# EAGLE design led reflector (EAGLE 6.2)
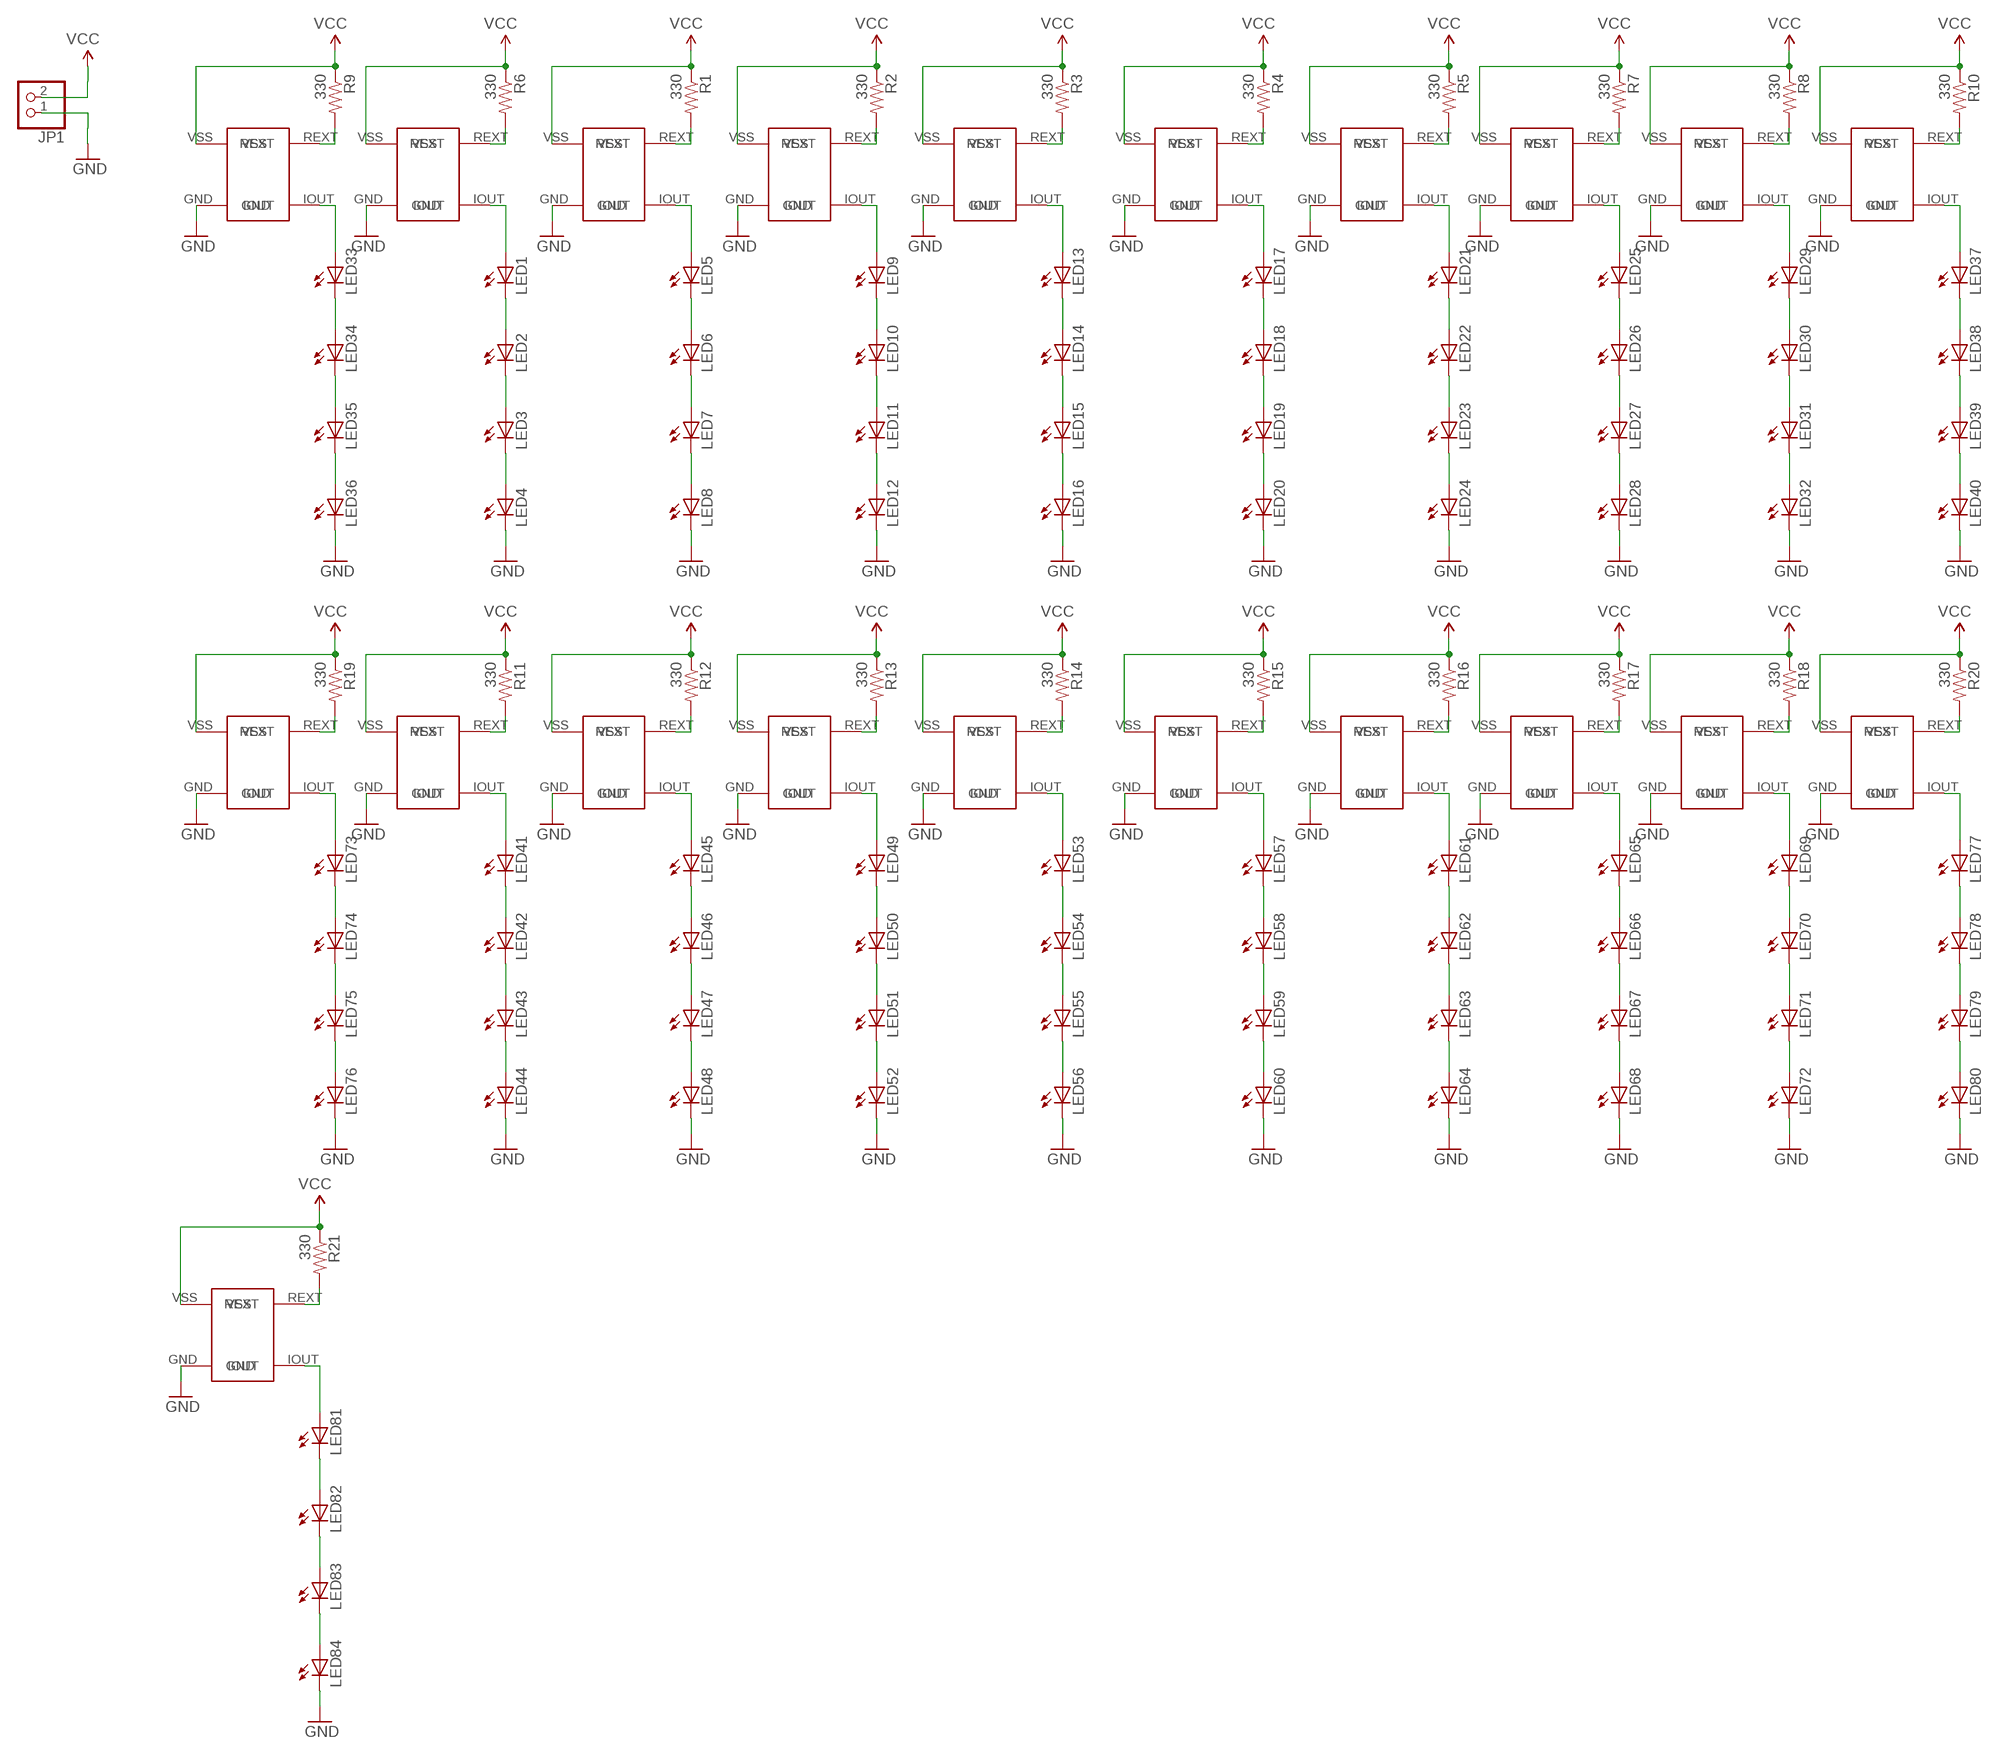
[diagram p0: schematic, sheet 1]

## Parts
JP1  PINHD-1X2  [1X02]
LED1  LED5MM  [LED5MM]
LED2  LED5MM  [LED5MM]
LED3  LED5MM  [LED5MM]
LED4  LED5MM  [LED5MM]
LED5  LED5MM  [LED5MM]
LED6  LED5MM  [LED5MM]
LED7  LED5MM  [LED5MM]
LED8  LED5MM  [LED5MM]
LED9  LED5MM  [LED5MM]
LED10  LED5MM  [LED5MM]
LED11  LED5MM  [LED5MM]
LED12  LED5MM  [LED5MM]
LED13  LED5MM  [LED5MM]
LED14  LED5MM  [LED5MM]
LED15  LED5MM  [LED5MM]
LED16  LED5MM  [LED5MM]
LED17  LED5MM  [LED5MM]
LED18  LED5MM  [LED5MM]
LED19  LED5MM  [LED5MM]
LED20  LED5MM  [LED5MM]
LED21  LED5MM  [LED5MM]
LED22  LED5MM  [LED5MM]
LED23  LED5MM  [LED5MM]
LED24  LED5MM  [LED5MM]
LED25  LED5MM  [LED5MM]
LED26  LED5MM  [LED5MM]
LED27  LED5MM  [LED5MM]
LED28  LED5MM  [LED5MM]
LED29  LED5MM  [LED5MM]
LED30  LED5MM  [LED5MM]
LED31  LED5MM  [LED5MM]
LED32  LED5MM  [LED5MM]
LED33  LED5MM  [LED5MM]
LED34  LED5MM  [LED5MM]
LED35  LED5MM  [LED5MM]
LED36  LED5MM  [LED5MM]
LED37  LED5MM  [LED5MM]
LED38  LED5MM  [LED5MM]
LED39  LED5MM  [LED5MM]
LED40  LED5MM  [LED5MM]
LED41  LED5MM  [LED5MM]
LED42  LED5MM  [LED5MM]
LED43  LED5MM  [LED5MM]
LED44  LED5MM  [LED5MM]
LED45  LED5MM  [LED5MM]
LED46  LED5MM  [LED5MM]
LED47  LED5MM  [LED5MM]
LED48  LED5MM  [LED5MM]
LED49  LED5MM  [LED5MM]
LED50  LED5MM  [LED5MM]
LED51  LED5MM  [LED5MM]
LED52  LED5MM  [LED5MM]
LED53  LED5MM  [LED5MM]
LED54  LED5MM  [LED5MM]
LED55  LED5MM  [LED5MM]
LED56  LED5MM  [LED5MM]
LED57  LED5MM  [LED5MM]
LED58  LED5MM  [LED5MM]
LED59  LED5MM  [LED5MM]
LED60  LED5MM  [LED5MM]
LED61  LED5MM  [LED5MM]
LED62  LED5MM  [LED5MM]
LED63  LED5MM  [LED5MM]
LED64  LED5MM  [LED5MM]
LED65  LED5MM  [LED5MM]
LED66  LED5MM  [LED5MM]
LED67  LED5MM  [LED5MM]
LED68  LED5MM  [LED5MM]
LED69  LED5MM  [LED5MM]
LED70  LED5MM  [LED5MM]
LED71  LED5MM  [LED5MM]
LED72  LED5MM  [LED5MM]
LED73  LED5MM  [LED5MM]
LED74  LED5MM  [LED5MM]
LED75  LED5MM  [LED5MM]
LED76  LED5MM  [LED5MM]
LED77  LED5MM  [LED5MM]
LED78  LED5MM  [LED5MM]
LED79  LED5MM  [LED5MM]
LED80  LED5MM  [LED5MM]
LED81  LED5MM  [LED5MM]
LED82  LED5MM  [LED5MM]
LED83  LED5MM  [LED5MM]
LED84  LED5MM  [LED5MM]
R1  330  RESISTOR  [0805]
R2  330  RESISTOR  [0805]
R3  330  RESISTOR  [0805]
R4  330  RESISTOR  [0805]
R5  330  RESISTOR  [0805]
R6  330  RESISTOR  [0805]
R7  330  RESISTOR  [0805]
R8  330  RESISTOR  [0805]
R9  330  RESISTOR  [0805]
R10  330  RESISTOR  [0805]
R11  330  RESISTOR  [0805]
R12  330  RESISTOR  [0805]
R13  330  RESISTOR  [0805]
R14  330  RESISTOR  [0805]
R15  330  RESISTOR  [0805]
R16  330  RESISTOR  [0805]
R17  330  RESISTOR  [0805]
R18  330  RESISTOR  [0805]
R19  330  RESISTOR  [0805]
R20  330  RESISTOR  [0805]
R21  330  RESISTOR  [0805]
U$1  BCR401W  [SOT-343]
U$2  BCR401W  [SOT-343]
U$3  BCR401W  [SOT-343]
U$4  BCR401W  [SOT-343]
U$5  BCR401W  [SOT-343]
U$6  BCR401W  [SOT-343]
U$7  BCR401W  [SOT-343]
U$8  BCR401W  [SOT-343]
U$9  BCR401W  [SOT-343]
U$10  BCR401W  [SOT-343]
U$11  BCR401W  [SOT-343]
U$12  BCR401W  [SOT-343]
U$13  BCR401W  [SOT-343]
U$14  BCR401W  [SOT-343]
U$15  BCR401W  [SOT-343]
U$16  BCR401W  [SOT-343]
U$17  BCR401W  [SOT-343]
U$18  BCR401W  [SOT-343]
U$19  BCR401W  [SOT-343]
U$20  BCR401W  [SOT-343]
U$21  BCR401W  [SOT-343]

## Nets
3.3V: JP1.2 R1.1 R2.1 R3.1 R4.1 R5.1 R6.1 R7.1 R8.1 R9.1 R10.1 R11.1 R12.1 R13.1 R14.1 R15.1 R16.1 R17.1 R18.1 R19.1 R20.1 R21.1 U$1.VSS U$2.VSS U$3.VSS U$4.VSS U$5.VSS U$6.VSS U$7.VSS U$8.VSS U$9.VSS U$10.VSS U$11.VSS U$12.VSS U$13.VSS U$14.VSS U$15.VSS U$16.VSS U$17.VSS U$18.VSS U$19.VSS U$20.VSS U$21.VSS ; supply symbol labelled VCC
GND: JP1.1 LED4.K(C) LED8.K(C) LED12.K(C) LED16.K(C) LED20.K(C) LED24.K(C) LED28.K(C) LED32.K(C) LED36.K(C) LED40.K(C) LED44.K(C) LED48.K(C) LED52.K(C) LED56.K(C) LED60.K(C) LED64.K(C) LED68.K(C) LED72.K(C) LED76.K(C) LED80.K(C) LED84.K(C) U$1.GND U$2.GND U$3.GND U$4.GND U$5.GND U$6.GND U$7.GND U$8.GND U$9.GND U$10.GND U$11.GND U$12.GND U$13.GND U$14.GND U$15.GND U$16.GND U$17.GND U$18.GND U$19.GND U$20.GND U$21.GND
N$1: LED1.A U$1.IOUT
N$2: LED1.K(C) LED2.A
N$3: LED2.K(C) LED3.A
N$4: LED3.K(C) LED4.A
N$5: R6.2 U$1.REXT
N$6: LED41.A U$11.IOUT
N$7: LED5.A U$2.IOUT
N$8: LED5.K(C) LED6.A
N$9: LED6.K(C) LED7.A
N$10: LED7.K(C) LED8.A
N$11: R1.2 U$2.REXT
N$12: LED9.A U$3.IOUT
N$13: LED9.K(C) LED10.A
N$14: LED10.K(C) LED11.A
N$15: LED11.K(C) LED12.A
N$16: R2.2 U$3.REXT
N$17: LED13.A U$4.IOUT
N$18: LED13.K(C) LED14.A
N$19: LED14.K(C) LED15.A
N$20: LED15.K(C) LED16.A
N$21: R3.2 U$4.REXT
N$22: LED17.A U$5.IOUT
N$23: LED17.K(C) LED18.A
N$24: LED18.K(C) LED19.A
N$25: LED19.K(C) LED20.A
N$26: R4.2 U$5.REXT
N$27: LED21.A U$6.IOUT
N$28: LED21.K(C) LED22.A
N$29: LED22.K(C) LED23.A
N$30: LED23.K(C) LED24.A
N$31: R5.2 U$6.REXT
N$32: LED25.A U$7.IOUT
N$33: LED25.K(C) LED26.A
N$34: LED26.K(C) LED27.A
N$35: LED27.K(C) LED28.A
N$36: R7.2 U$7.REXT
N$37: LED29.A U$8.IOUT
N$38: LED29.K(C) LED30.A
N$39: LED30.K(C) LED31.A
N$40: LED31.K(C) LED32.A
N$41: R8.2 U$8.REXT
N$42: LED33.A U$9.IOUT
N$43: LED33.K(C) LED34.A
N$44: LED34.K(C) LED35.A
N$45: LED35.K(C) LED36.A
N$46: R9.2 U$9.REXT
N$47: LED37.A U$10.IOUT
N$48: LED37.K(C) LED38.A
N$49: LED38.K(C) LED39.A
N$50: LED39.K(C) LED40.A
N$51: R10.2 U$10.REXT
N$52: LED41.K(C) LED42.A
N$53: LED42.K(C) LED43.A
N$54: LED43.K(C) LED44.A
N$55: R11.2 U$11.REXT
N$56: LED45.A U$12.IOUT
N$57: LED45.K(C) LED46.A
N$58: LED46.K(C) LED47.A
N$59: LED47.K(C) LED48.A
N$60: R12.2 U$12.REXT
N$61: LED49.A U$13.IOUT
N$62: LED49.K(C) LED50.A
N$63: LED50.K(C) LED51.A
N$64: LED51.K(C) LED52.A
N$65: R13.2 U$13.REXT
N$66: LED53.A U$14.IOUT
N$67: LED53.K(C) LED54.A
N$68: LED54.K(C) LED55.A
N$69: LED55.K(C) LED56.A
N$70: R14.2 U$14.REXT
N$71: LED57.A U$15.IOUT
N$72: LED57.K(C) LED58.A
N$73: LED58.K(C) LED59.A
N$74: LED59.K(C) LED60.A
N$75: R15.2 U$15.REXT
N$76: LED61.A U$16.IOUT
N$77: LED61.K(C) LED62.A
N$78: LED62.K(C) LED63.A
N$79: LED63.K(C) LED64.A
N$80: R16.2 U$16.REXT
N$81: LED65.A U$17.IOUT
N$82: LED65.K(C) LED66.A
N$83: LED66.K(C) LED67.A
N$84: LED67.K(C) LED68.A
N$85: R17.2 U$17.REXT
N$86: LED69.A U$18.IOUT
N$87: LED69.K(C) LED70.A
N$88: LED70.K(C) LED71.A
N$89: LED71.K(C) LED72.A
N$90: R18.2 U$18.REXT
N$91: LED73.A U$19.IOUT
N$92: LED73.K(C) LED74.A
N$93: LED74.K(C) LED75.A
N$94: LED75.K(C) LED76.A
N$95: R19.2 U$19.REXT
N$96: LED77.A U$20.IOUT
N$97: LED77.K(C) LED78.A
N$98: LED78.K(C) LED79.A
N$99: LED79.K(C) LED80.A
N$100: R20.2 U$20.REXT
N$101: LED81.A U$21.IOUT
N$102: LED81.K(C) LED82.A
N$103: LED82.K(C) LED83.A
N$104: LED83.K(C) LED84.A
N$105: R21.2 U$21.REXT

## Library data of the parts
JP1 = pinhead:PINHD-1X2: PIN HEADER
LED1-LED84 = led:LED: LED OSRAM: - CHIPLED LG R971, LG N971, LY N971, LG Q971, LY Q971, LO R971, LY R971 LH N974, LH R974 LS Q976, LO Q976, LY Q976 LO Q996 - Hyper CHIPLED LW Q18S LB Q993, LB Q99A, LB R99A - SideLED LS A670, LO A670, LY A670, LG A670, LP A670 LB A673, LV A673, LT A673, LW A673 LH A674 LY A675 LS A676, LA A676, LO A676, LY A676, LW A676 LS A679, LY A679, LG A679 - Hyper Micro SIDELED® LS Y876, LA Y876, LO Y876, LY Y876 LT Y87S - SmartLED LW L88C, LW L88S LB L89C, LB L89S, LG L890 LS L89K, LO L89K, LY L89K LS L896, LA L896, LO L896, LY L896 - TOPLED LS T670, LO T670, LY T670, LG T670, LP T670 LSG T670, LSP T670, LSY T670, LOP T670, LYG T670 LG T671, LOG T671, LSG T671 LB T673, LV T673, LT T673, LW T673 LH T674 LS T676, LA T676, LO T676, LY T676, LB T676, LH T676, LSB T676, LW T676 LB T67C, LV T67C, LT T67C, LS T67K, LO T67K, LY T67K, LW E67C LS E67B, LA E67B, LO E67B, LY E67B, LB E67C, LV E67C, LT E67C LW T67C LS T679, LY T679, LG T679 LS T770, LO T770, LY T770, LG T770, LP T770 LB T773, LV T773, LT T773, LW T773 LH T774 LS E675, LA E675, LY E675, LS T675 LS T776, LA T776, LO T776, LY T776, LB T776 LHGB T686 LT T68C, LB T68C - Hyper Mini TOPLED® LB M676 - Mini TOPLED Santana® LG M470 LS M47K, LO M47K, LY M47K Source: http://www.osram.convergy.de LUXEON: - LUMILED® LXK2-PW12-R00, LXK2-PW12-S00, LXK2-PW14-U00, LXK2-PW14-V00 LXK2-PM12-R00, LXK2-PM12-S00, LXK2-PM14-U00 LXK2-PE12-Q00, LXK2-PE12-R00, LXK2-PE12-S00, LXK2-PE14-T00, LXK2-PE14-U00 LXK2-PB12-K00, LXK2-PB12-L00, LXK2-PB12-M00, LXK2-PB14-N00, LXK2-PB14-P00, LXK2-PB14-Q00 LXK2-PR12-L00, LXK2-PR12-M00, LXK2-PR14-Q00, LXK2-PR14-R00 LXK2-PD12-Q00, LXK2-PD12-R00, LXK2-PD12-S00 LXK2-PH12-R00, LXK2-PH12-S00 LXK2-PL12-P00, LXK2-PL12-Q00, LXK2-PL12-R00 Source: www.luxeon.com KINGBRIGHT: KA-3528ASYC Source: www.kingbright.com
R1-R21 = SparkFun:RESISTOR: Resistor Basic schematic elements and footprints for 0603, 1206, and PTH 1/10th watt (small) resistors.
U$1-U$21 = bcr401w:BCR401W: LED DRIVER, LOW POWER LEDS, 4SOT343 LED Driver Application: Aircraft, LED Strips for Decorative Lighting, Ship Illumination, Train Topology: Constant Current No. of Outputs: 1 Output Current: 10mA Output Voltage: 16V Dimming Control Type: Digital Driver Case Style: SOT-343 SVHC: No SVHC (19-Dec-2011) Device Type: LED No. of Pins: 4 Supply Voltage Max: 18V Termination Type: SMD http://ro.farnell.com/infineon/bcr401w/led-driver-low-power-leds-4sot343/dp/1791058

## Board
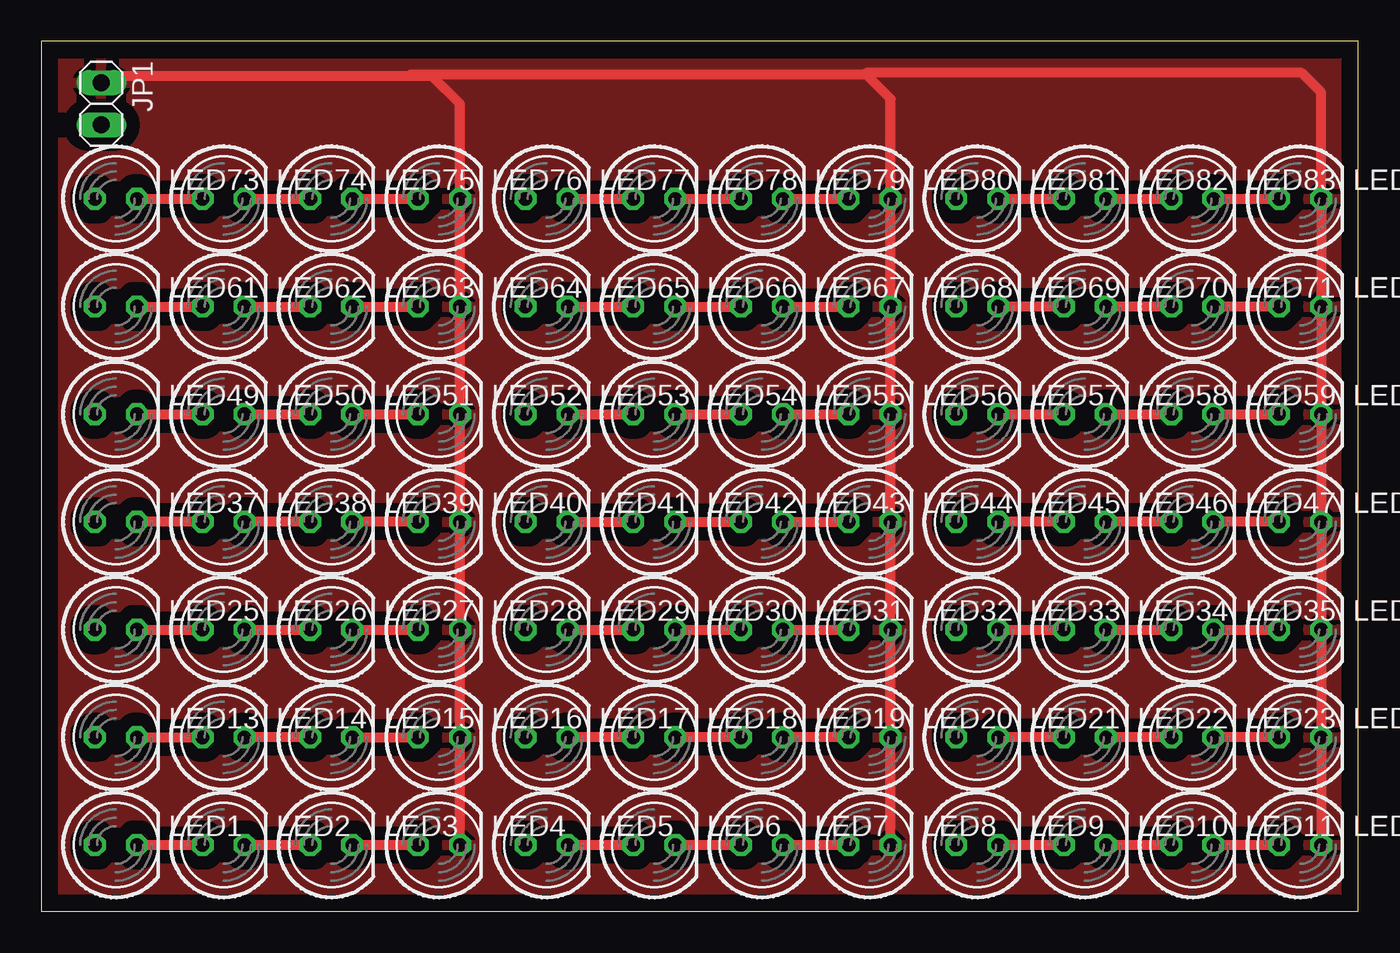
[diagram p1: board, top side]
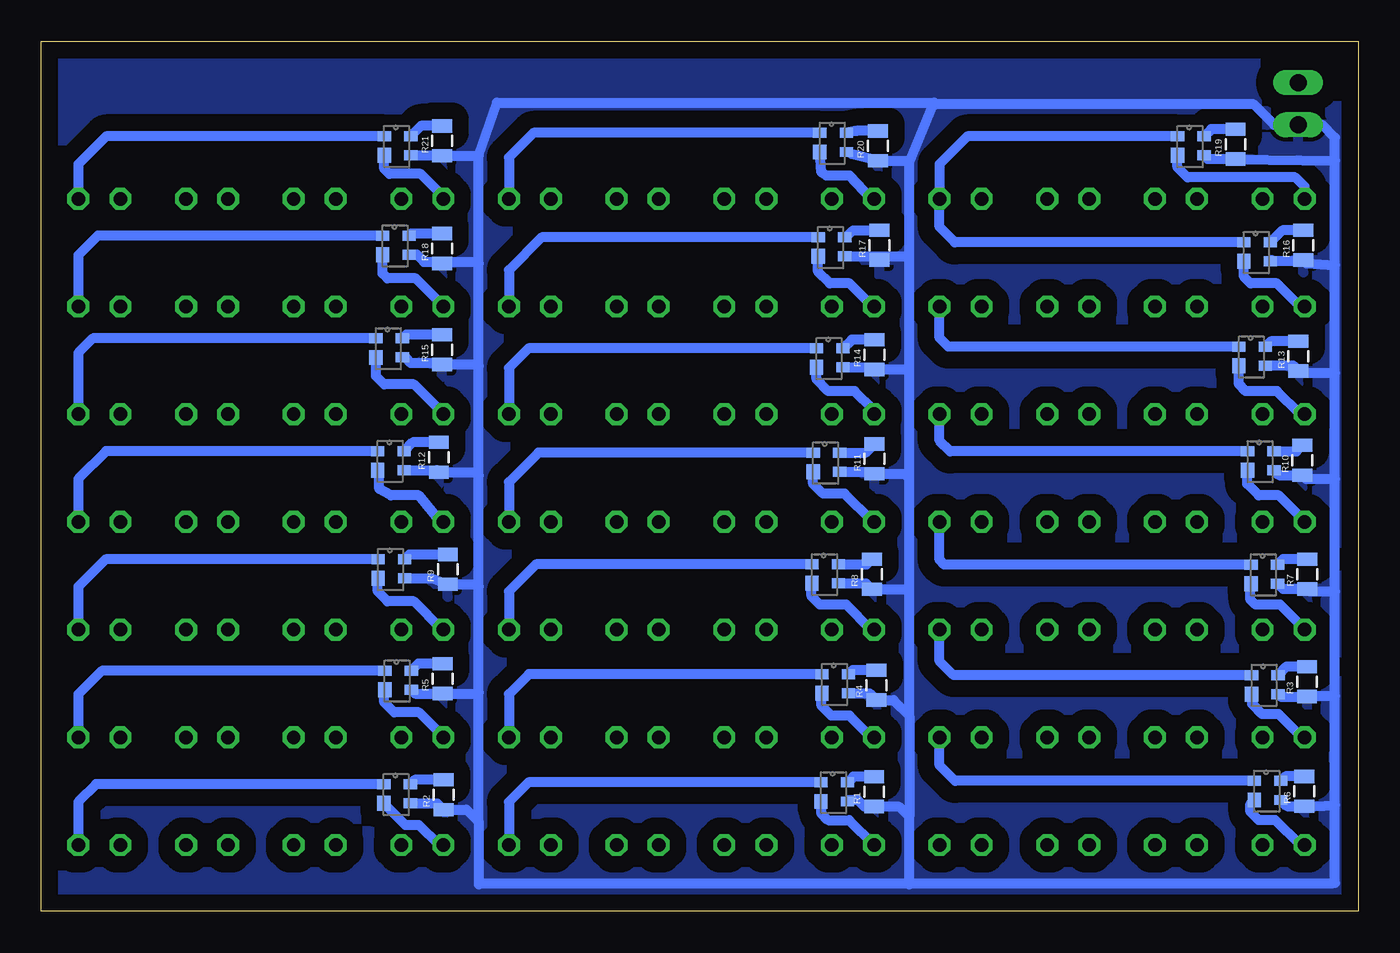
[diagram p2: board, bottom side, seen from below]

Size 79.5 x 52.5 mm. Coordinates in mm from the lower left corner, seen from the top.
Outline: 0,0 79.5,0 79.5,52.5 0,52.5 0,0
Copper layers (1*16): Top 0.035mm / dielectric 1.5mm / Bottom 0.035mm
Design rules: minimum track width 10mil, minimum drill 24mil, track to track 8mil, track to pad 8mil, pad to pad 8mil, via to via 8mil, smd to smd 8mil, copper to edge 40mil, drill to drill 8mil, minimum pad ring 10mil, minimum via ring 8mil, stop-mask expansion 4mil, vias tented up to drill 0mil, thermal gap 10mil

### Footprints (pad centres in the part's own frame; a part is rotated, then mirrored left to right if it is on the bottom)
1X02 = drill 1.016 long: 1 -1.27,0; 2 1.27,0
LED5MM = drill 0.813 octagon: A -1.27,0; K 1.27,0
0805 = smd 0.8 x 1.2: 1 -0.9,0; 2 0.9,0
SOT-343 = smd 0.6 x 0.8: GND -0.575,-0.8; REXT -0.575,0.8; VSS 0.575,0.8 | smd 0.9 x 0.8: IOUT 0.575,-0.8

### Placement (x,y rotation side)
JP1  3.62,48.74 270 top
LED1  4.5,4 0 top
LED2  11,4 0 top
LED3  17.5,4 0 top
LED4  24,4 0 top
LED5  30.5,4 0 top
LED6  37,4 0 top
LED7  43.5,4 0 top
LED8  50,4 0 top
LED9  56.5,4 0 top
LED10  63,4 0 top
LED11  69.5,4 0 top
LED12  76,4 0 top
LED13  4.5,10.5 0 top
LED14  11,10.5 0 top
LED15  17.5,10.5 0 top
LED16  24,10.5 0 top
LED17  30.5,10.5 0 top
LED18  37,10.5 0 top
LED19  43.5,10.5 0 top
LED20  50,10.5 0 top
LED21  56.5,10.5 0 top
LED22  63,10.5 0 top
LED23  69.5,10.5 0 top
LED24  76,10.5 0 top
LED25  4.5,17 0 top
LED26  11,17 0 top
LED27  17.5,17 0 top
LED28  24,17 0 top
LED29  30.5,17 0 top
LED30  37,17 0 top
LED31  43.5,17 0 top
LED32  50,17 0 top
LED33  56.5,17 0 top
LED34  63,17 0 top
LED35  69.5,17 0 top
LED36  76,17 0 top
LED37  4.5,23.5 0 top
LED38  11,23.5 0 top
LED39  17.5,23.5 0 top
LED40  24,23.5 0 top
LED41  30.5,23.5 0 top
LED42  37,23.5 0 top
LED43  43.5,23.5 0 top
LED44  50,23.5 0 top
LED45  56.5,23.5 0 top
LED46  63,23.5 0 top
LED47  69.5,23.5 0 top
LED48  76,23.5 0 top
LED49  4.5,30 0 top
LED50  11,30 0 top
LED51  17.5,30 0 top
LED52  24,30 0 top
LED53  30.5,30 0 top
LED54  37,30 0 top
LED55  43.5,30 0 top
LED56  50,30 0 top
LED57  56.5,30 0 top
LED58  63,30 0 top
LED59  69.5,30 0 top
LED60  76,30 0 top
LED61  4.5,36.5 0 top
LED62  11,36.5 0 top
LED63  17.5,36.5 0 top
LED64  24,36.5 0 top
LED65  30.5,36.5 0 top
LED66  37,36.5 0 top
LED67  43.5,36.5 0 top
LED68  50,36.5 0 top
LED69  56.5,36.5 0 top
LED70  63,36.5 0 top
LED71  69.5,36.5 0 top
LED72  76,36.5 0 top
LED73  4.5,43 0 top
LED74  11,43 0 top
LED75  17.5,43 0 top
LED76  24,43 0 top
LED77  30.5,43 0 top
LED78  37,43 0 top
LED79  43.5,43 0 top
LED80  50,43 0 top
LED81  56.5,43 0 top
LED82  63,43 0 top
LED83  69.5,43 0 top
LED84  76,43 0 top
R1  29.22,7.22 90 bottom
R2  55.22,7.03 90 bottom
R3  3.08,13.86 90 bottom
R4  29.08,13.65 90 bottom
R5  55.28,14.04 90 bottom
R6  3.24,7.24 90 bottom
R7  3.06,20.35 90 bottom
R8  29.36,20.34 90 bottom
R9  54.96,20.63 90 bottom
R10  3.36,27.22 90 bottom
R11  29.2,27.3 90 bottom
R12  55.5,27.4 90 bottom
R13  3.6,33.5 90 bottom
R14  29.2,33.6 90 bottom
R15  55.3,33.9 90 bottom
R16  3.3,40.2 90 bottom
R17  28.9,40.2 90 bottom
R18  55.3,40 90 bottom
R19  7.4,46.3 90 bottom
R20  29,46.2 90 bottom
R21  55.3,46.5 90 bottom
U$1  5.47,7.29 270 bottom
U$2  31.63,7.2 270 bottom
U$3  58.03,7.09 270 bottom
U$4  5.63,13.68 270 bottom
U$5  31.57,13.73 270 bottom
U$6  57.97,13.94 270 bottom
U$7  5.67,20.35 270 bottom
U$8  32.17,20.36 270 bottom
U$9  58.37,20.67 270 bottom
U$10  5.87,27.18 270 bottom
U$11  32.1,27.1 270 bottom
U$12  58.4,27.2 270 bottom
U$13  6.4,33.5 270 bottom
U$14  31.9,33.4 270 bottom
U$15  58.5,34 270 bottom
U$16  6.1,39.8 270 bottom
U$17  31.8,40.1 270 bottom
U$18  58.1,40.2 270 bottom
U$19  10.1,46.2 270 bottom
U$20  31.7,46.4 270 bottom
U$21  58,46.2 270 bottom

### Tracks (layer width: path | path; a pad name or v marks a point on that pad's centre or on a via)
3.3V
  Bottom 0.61: U$2.VSS 30.75,6.7 30.2,6.7 29.82,6.32 R1.1 29.2,6.3 27.7,6.3 27.1,5.7 | 27.1,1.6 27.1,5.7 | U$3.VSS 55.6,6.51 R2.1 53.83,6.13 53.1,5.4 | 53.1,5.4 53.1,1.6 53,1.7 1.5,1.7 | U$4.VSS 4.68,12.96 R3.1 3.04,13 1.4,13 | U$5.VSS 29.48,13.15 R4.1 28.05,12.75 27.1,11.8 | 27.1,11.8 27.1,5.7 | 27.1,11.8 27.1,19.5 | 27.1,19.5 27.1,26.1 | 27.1,26.1 27.1,32.5 | 27.1,32.5 27.1,39.4 | 27.1,39.4 27.1,45.2 | 27.1,45.2 25.6,48.8 | 53.1,5.4 53.1,13.2 | 53.1,13.2 53.1,19.6 | 53.1,19.6 53.1,26.3 | 53.1,26.3 53.1,32.9 | 53.1,32.9 53.1,39.1 | 53.1,39.1 53.1,45.6 | 53.1,45.6 52,48.8 25.6,48.8 | U$6.VSS 56.95,13.14 R5.1 53.16,13.14 53.1,13.2 | 27.1,19.5 27.16,19.44 R8.1 29.7,19.79 U$8.VSS | U$9.VSS 55.92,20.09 R9.1 53.23,19.73 53.1,19.6 | U$11.VSS 29.32,26.52 R11.1 27.4,26.4 27.1,26.1 | U$14.VSS 29.32,32.83 R14.1 27.3,32.7 27.1,32.5 | U$17.VSS 29.12,39.52 | 29.12,39.52 R17.1 | 29.12,39.52 27.23,39.52 27.1,39.4 | U$20.VSS 30.57,45.7 R20.1 27.2,45.3 27.1,45.2 | 25.6,48.8 25.5,48.7 6.3,48.7 5.07,47.47 JP1.2 2.17,47.47 1.4,46.7 1.4,45.3 | U$19.VSS 9.07,45.4 R19.1 1.4,45.3 | 5.22,39.3 U$16.VSS 3.38,39.23 R16.1 3.1,39.1 1.4,39 | U$12.VSS 55.62,26.62 R12.1 53.3,26.5 53.1,26.3 | U$15.VSS 57.52,33.42 57.2,33.1 55.4,33.1 R15.1 53.2,33 53.1,32.9 | U$18.VSS 56.83,39.62 56.4,39.2 | 56.4,39.2 55.4,39.2 R18.1 | U$21.VSS 55.33,45.62 R21.1 53.1,45.6 | 56.4,39.2 53.2,39.2 53.1,39.1 | 1.4,1.7 1.4,6.4 | 1.4,6.4 1.4,13 | 1.4,13 1.4,19.3 | 1.4,19.3 1.4,26.1 | 1.4,26.1 1.4,32.5 | 1.4,32.5 1.4,39 | 1.4,39 1.4,45.3 | 1.4,6.4 3.2,6.3 R6.1 4.29,6.34 U$1.VSS | 1.4,19.3 2.91,19.3 R7.1 4.54,19.45 U$7.VSS | 1.4,26.1 3.14,26.1 R10.1 4.79,26.32 U$10.VSS | 1.4,32.5 3.5,32.5 R13.1 3.92,32.92 U$13.VSS
  pour Bottom (isolate 1.016): 0.7,51.3 79.4,51.3 79.4,0.7 0.5,0.1
GND
  Top 0.61: LED4.K LED16.K LED28.K LED40.K LED52.K LED64.K 25.27,41.3 | 25.27,41.3 LED76.K | 25.27,41.3 25.27,48.73 23.6,50.4 22.2,50.4 | 22.2,50.4 4.01,50.4 JP1.1 | 49.7,50.5 49.8,50.5 51.27,49.03 LED80.K LED68.K LED56.K LED44.K LED32.K LED20.K LED8.K | 49.7,50.5 22.3,50.5 22.2,50.4 | 49.7,50.5 49.8,50.6 76.1,50.6 77.27,49.43 LED84.K LED72.K LED60.K LED48.K LED36.K LED24.K LED12.K
  Bottom 0.61: U$16.GND 24.34,40.38 25.27,41.3 25.27,42.5 | 25.27,42.5 LED76.K | U$19.GND 23.59,46.77 25.27,45.1 25.27,42.5 | U$13.GND 24.75,34.08 25.27,34.6 LED64.K | U$10.GND 24.62,27.75 25.27,28.4 LED52.K | U$7.GND 25,20.93 25.27,21.2 LED40.K | U$4.GND 24.43,14.26 25.27,15.1 LED28.K | U$1.GND 24.34,7.87 25.27,8.8 LED16.K | U$21.GND 75.59,46.77 77.27,45.1 LED84.K | U$18.GND 76.09,40.77 77.27,39.6 LED72.K | U$15.GND 76.39,34.58 77.27,33.7 LED60.K | U$12.GND 75.59,27.77 77.27,26.1 LED48.K | U$9.GND 75.62,21.25 77.27,19.6 LED36.K | U$6.GND 75.86,14.52 77.27,13.1 LED24.K | U$3.GND 76.2,7.67 77.27,6.6 LED12.K | U$2.GND 50.09,7.78 51.27,6.6 LED8.K | U$5.GND 50.06,14.3 51.27,13.1 LED20.K | U$8.GND 49.63,20.93 51.27,19.3 LED32.K | U$11.GND 49.49,27.68 51.27,25.9 LED44.K | U$14.GND 50.09,33.98 51.27,32.8 LED56.K | U$17.GND 49.3,40.67 51.27,38.7 LED68.K | U$20.GND 49.8,46.98 51.27,45.5 LED80.K
  pour Top (isolate 0.813): 0.6,51.3 79.4,51.3 79.4,0.7 0.6,0.7
N$1
  Bottom 0.61: LED1.A 3.5,4 5,5.5 6,5.5 6.5,6 6.5,6.49 U$1.IOUT
N$2
  Top 0.61: LED1.K LED2.A
N$3
  Top 0.61: LED2.K LED3.A
N$4
  Top 0.61: LED3.K LED4.A
N$5
  Bottom 0.61: R6.2 4.39,8.14 U$1.REXT
N$6
  Bottom 0.61: LED41.A 29.3,23.5 31,25.2 32.3,25.2 32.9,25.8 U$11.IOUT
N$7
  Bottom 0.61: U$2.IOUT 32.43,5.93 32,5.5 30.73,5.5 LED5.A
N$8
  Top 0.61: LED5.K LED6.A
N$9
  Top 0.61: LED6.K LED7.A
N$10
  Top 0.61: LED7.K LED8.A
N$11
  Bottom 0.61: R1.2 30.48,8.12 U$2.REXT
N$12
  Bottom 0.61: LED9.A 55.5,4 56.7,5.2 57.52,5.2 U$3.IOUT
N$13
  Top 0.61: LED9.K LED10.A
N$14
  Top 0.61: LED10.K LED11.A
N$15
  Top 0.61: LED11.K LED12.A
N$16
  Bottom 0.61: R2.2 56.97,7.93 U$3.REXT
N$17
  Bottom 0.61: LED13.A 3.4,10.5 4.8,11.9 5.8,11.9 6.4,12.5 6.4,13.07 U$4.IOUT
N$18
  Top 0.61: LED13.K LED14.A
N$19
  Top 0.61: LED15.A LED14.K
N$20
  Top 0.61: LED15.K LED16.A
N$21
  Bottom 0.61: R3.2 4.33,14.76 U$4.REXT
N$22
  Bottom 0.61: LED17.A 29.4,10.5 30.7,11.8 31.8,11.8 32.4,12.4 32.4,13.12 U$5.IOUT
N$23
  Top 0.61: LED18.A LED17.K
N$24
  Top 0.61: LED19.A LED18.K
N$25
  Top 0.61: LED20.A LED19.K
N$26
  Bottom 0.61: R4.2 30.52,14.55 U$5.REXT
N$27
  Bottom 0.61: LED21.A 55.23,10.53 56.7,12 58.2,12 58.8,12.6 58.8,13.34 U$6.IOUT
N$28
  Top 0.61: LED22.A LED21.K
N$29
  Top 0.61: LED23.A LED22.K
N$30
  Top 0.61: LED24.A LED23.K
N$31
  Bottom 0.61: R5.2 56.74,14.94 U$6.REXT
N$32
  Bottom 0.61: LED25.A 3.23,17.03 4.7,18.5 6.2,18.5 6.5,18.8 6.5,19.75 U$7.IOUT
N$33
  Top 0.61: LED25.K LED26.A
N$34
  Top 0.61: LED26.K LED27.A
N$35
  Top 0.61: LED27.K LED28.A
N$36
  Bottom 0.61: R7.2 4.54,21.25 U$7.REXT
N$37
  Bottom 0.61: LED29.A 29.4,17 30.9,18.5 32.5,18.5 33,19 33,19.75 U$8.IOUT
N$38
  Top 0.61: LED29.K LED30.A
N$39
  Top 0.61: LED30.K LED31.A
N$40
  Top 0.61: LED31.K LED32.A
N$41
  Bottom 0.61: U$8.REXT 29.66,20.93 R8.2
N$42
  Bottom 0.61: LED33.A 55.3,17 57,18.7 58.6,18.7 59.2,19.3 59.2,20.07 U$9.IOUT
N$43
  Top 0.61: LED33.K LED34.A
N$44
  Top 0.61: LED34.K LED35.A
N$45
  Top 0.61: LED35.K LED36.A
N$46
  Bottom 0.61: R9.2 57.28,21.53 U$9.REXT
N$47
  Bottom 0.61: LED37.A 3.23,23.53 4.8,25.1 6,25.1 6.7,25.8 6.7,26.57 U$10.IOUT
N$48
  Top 0.61: LED38.A LED37.K
N$49
  Top 0.61: LED39.A LED38.K
N$50
  Top 0.61: LED40.A LED39.K
N$51
  Bottom 0.61: U$10.REXT 3.73,27.75 R10.2
N$52
  Top 0.61: LED41.K LED42.A
N$53
  Top 0.61: LED42.K LED43.A
N$54
  Top 0.61: LED43.K LED44.A
N$55
  Bottom 0.61: U$11.REXT 29.73,27.68 R11.2
N$56
  Bottom 0.61: LED45.A 55.4,23.5 56.7,25.1 58.4,25.1 59.1,25.5 59.1,26.52 U$12.IOUT
N$57
  Top 0.61: LED46.A LED45.K
N$58
  Top 0.61: LED47.A LED46.K
N$59
  Top 0.61: LED48.A LED47.K
N$60
  Bottom 0.61: R12.2 57.08,28.3 U$12.REXT
N$61
  Bottom 0.61: LED49.A 3.5,30 4.9,31.4 6.8,31.4 7.2,31.8 U$13.IOUT
N$62
  Top 0.61: LED49.K LED50.A
N$63
  Top 0.61: LED50.K LED51.A
N$64
  Top 0.61: LED51.K LED52.A
N$65
  Bottom 0.61: R13.2 5.28,34.4 U$13.REXT
N$66
  Bottom 0.61: LED53.A 29.23,30.23 30.4,31.4 32,31.4 32.7,32.1 U$14.IOUT
N$67
  Top 0.61: LED53.K LED54.A
N$68
  Top 0.61: LED54.K LED55.A
N$69
  Top 0.61: LED55.K LED56.A
N$70
  Bottom 0.61: R14.2 30.57,34.5 U$14.REXT
N$71
  Bottom 0.61: LED57.A 55.23,30.03 57,31.8 58.8,31.8 59.3,32.3 U$15.IOUT
N$72
  Top 0.61: LED57.K LED58.A
N$73
  Top 0.61: LED58.K LED59.A
N$74
  Top 0.61: LED59.K LED60.A
N$75
  Bottom 0.61: R15.2 57.48,34.8 U$15.REXT
N$76
  Bottom 0.61: LED61.A 3.5,36.5 4.9,37.9 6.5,37.9 6.9,38.3 U$16.IOUT
N$77
  Top 0.61: LED61.K LED62.A
N$78
  Top 0.61: LED62.K LED63.A
N$79
  Top 0.61: LED63.K LED64.A
N$80
  Bottom 0.61: R16.2 4.58,41.1 U$16.REXT
N$81
  Bottom 0.61: LED65.A 29.3,36.5 30.7,37.9 31.9,37.9 32.6,38.6 U$17.IOUT
N$82
  Top 0.61: LED65.K LED66.A
N$83
  Top 0.61: LED66.K LED67.A
N$84
  Top 0.61: LED67.K LED68.A
N$85
  Bottom 0.61: U$17.REXT 30.93,40.67 30.5,41.1 R17.2
N$86
  Bottom 0.61: LED69.A 55.23,36.53 56.9,38.2 58.6,38.2 58.9,38.5 U$18.IOUT
N$87
  Top 0.61: LED70.A LED69.K
N$88
  Top 0.61: LED71.A LED70.K
N$89
  Top 0.61: LED72.A LED71.K
N$90
  Bottom 0.61: R18.2 57.17,40.9 U$18.REXT
N$91
  Bottom 0.61: LED73.A 3.23,43.73 3.8,44.3 10.3,44.3 10.9,44.9 U$19.IOUT
N$92
  Top 0.61: LED73.K LED74.A
N$93
  Top 0.61: LED74.K LED75.A
N$94
  Top 0.61: LED75.K LED76.A
N$95
  Bottom 0.61: R19.2 8.88,47.2 U$19.REXT
N$96
  Bottom 0.61: LED77.A 29.4,43 30.7,44.4 32.1,44.4 32.4,44.6 U$20.IOUT
N$97
  Top 0.61: LED77.K LED78.A
N$98
  Top 0.61: LED78.K LED79.A
N$99
  Top 0.61: LED79.K LED80.A
N$100
  Bottom 0.61: R20.2 30.27,47.1 U$20.REXT
N$101
  Bottom 0.61: LED81.A 55.23,43.13 56.6,44.5 58.5,44.5 58.8,44.8 U$21.IOUT
N$102
  Top 0.61: LED81.K LED82.A
N$103
  Top 0.61: LED82.K LED83.A
N$104
  Top 0.61: LED83.K LED84.A
N$105
  Bottom 0.61: R21.2 56.58,47.4 U$21.REXT